# Altium project PIF_robot.PrjPcb
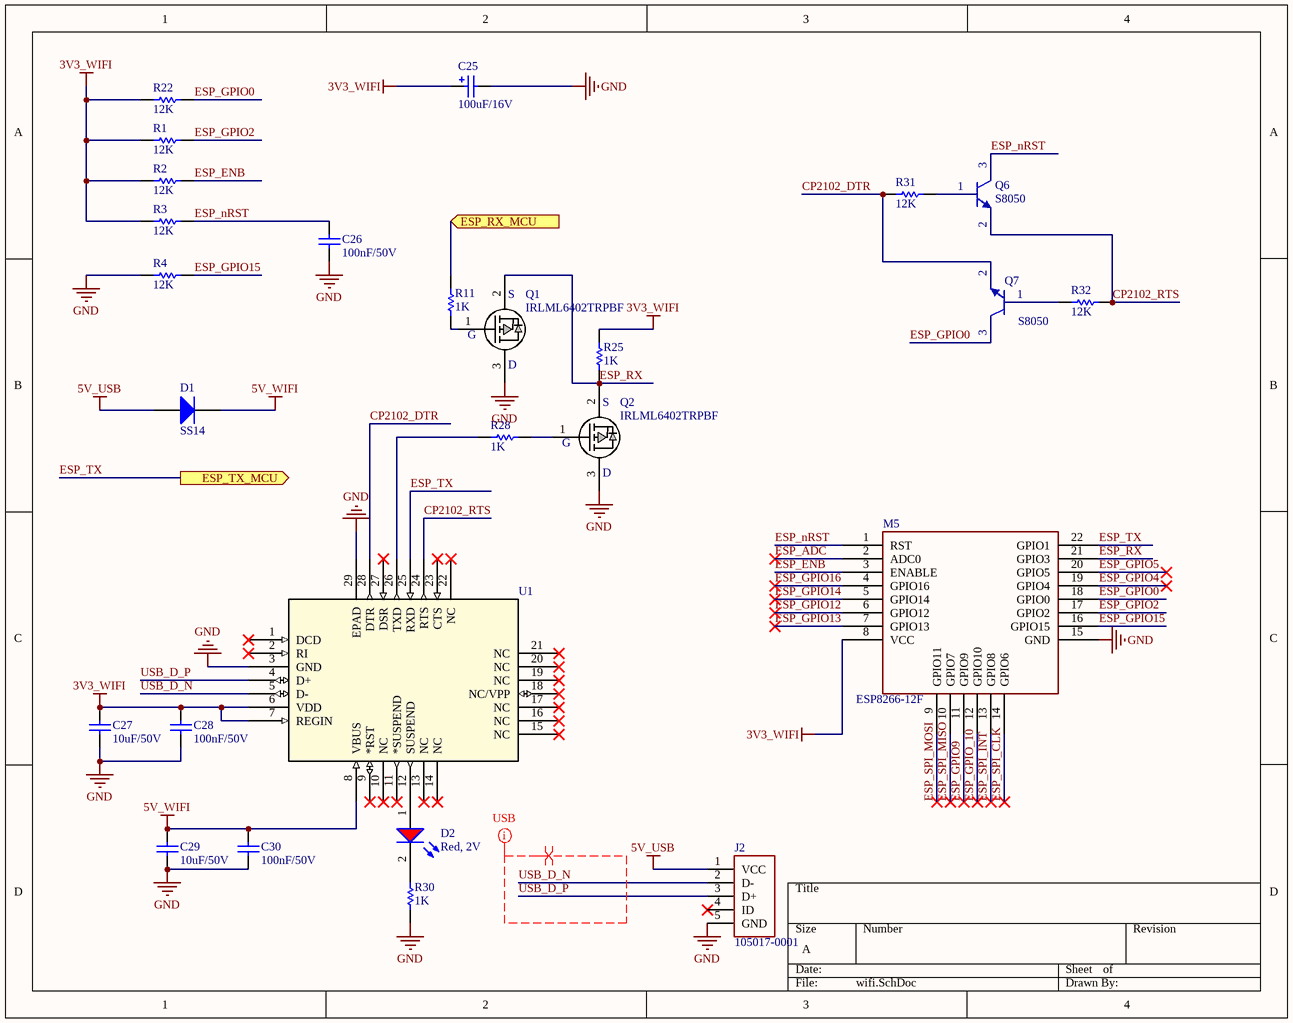
[diagram p0: wifi.SchDoc]
8 sheets, 159 parts. Net scope: flat (ports and power ports of the same name join across sheets).
Board file: PIF_robot.PcbDoc
Sheets:
  wifi.SchDoc
  Sensor.SchDoc
  RF.SchDoc
  Motor Control.SchDoc
  Decawave.schdoc
  Power_Supply.SchDoc
  Bluetooth.SchDoc
  MCU.schdoc

## Sheet wifi.SchDoc
size A

### Parts
C25  value 100uF/16V  [CAP_SM_TAN]  (hidden comment: TAJB107M006RNJ)
C26  value 100nF/50V  [CAP-SM-0805]  (hidden comment: Cap-100nF-50V-0805)
C27  value 10uF/50V  [CAP-SM-0805]  (hidden comment: Cap-10uF-50V-0805)
C28  value 100nF/50V  [CAP-SM-0805]  (hidden comment: Cap-100nF-50V-0805)
C29  value 10uF/50V  [CAP-SM-0805]  (hidden comment: Cap-10uF-50V-0805)
C30  value 100nF/50V  [CAP-SM-0805]  (hidden comment: Cap-100nF-50V-0805)
D1  SS14  [SS14]
D2  value Red, 2V  [LED_0805_Blue]  (hidden comment: LED-RED-TH-3mm)
J2  105017-0001  [CONN_105017-0001]
M5  ESP8266-12F  [ESP8266-12F]
Q1  IRLML6402TRPBF  [SOT23_NEX]
Q2  IRLML6402TRPBF  [SOT23_NEX]
Q6  S8050  [SOT23_NEX]
Q7  S8050  [SOT23_NEX]
R1  value 12K  [RES-SM-0805]  (hidden comment: Res-12K-0805)
R2  value 12K  [RES-SM-0805]  (hidden comment: Res-12K-0805)
R3  value 12K  [RES-SM-0805]  (hidden comment: Res-12K-0805)
R4  value 12K  [RES-SM-0805]  (hidden comment: Res-12K-0805)
R11  value 1K  [RES-SM-0805]  (hidden comment: Res-1K-0805)
R22  value 12K  [RES-SM-0805]  (hidden comment: Res-12K-0805)
R25  value 1K  [RES-SM-0805]  (hidden comment: Res-1K-0805)
R28  value 1K  [RES-SM-0805]  (hidden comment: Res-1K-0805)
R30  value 1K  [RES-SM-0805]  (hidden comment: Res-1K-0805)
R31  value 12K  [RES-SM-0805]  (hidden comment: Res-12K-0805)
R32  value 12K  [RES-SM-0805]  (hidden comment: Res-12K-0805)
U1  (no value)  [CP2102-GM]

### Ports
ESP_RX_MCU (in), ESP_TX_MCU (out)

### Nets
3V3_WIFI: C25.1 C27.2 C28.2 M5.8(VCC) R1.1 R2.1 R3.1 R22.1 R25.1 U1.6(VDD) U1.7(REGIN)
5V_USB: D1.2(A) J2.1(VCC)
5V_WIFI: C29.2 C30.2 D1.1(K) U1.8(VBUS)
GND: C25.2 C26.1 C27.1 C28.1 C29.1 C30.1 J2.5(GND) M5.15(GND) Q1.3(D) Q2.3(D) R4.1 R30.1 U1.3(GND) U1.29(EPAD)
CP2102_DTR: Q7.2(E) R31.1 U1.28(DTR)
CP2102_RTS: Q6.2(E) R32.2 U1.24(RTS)
ESP_ADC: M5.2(ADC0)
ESP_ENB: M5.3(ENABLE) R2.2
ESP_GPIO0: M5.18(GPIO0) Q7.3(C) R22.2
ESP_GPIO2: M5.17(GPIO2) R1.2
ESP_GPIO4: M5.19(GPIO4)
ESP_GPIO5: M5.20(GPIO5)
ESP_GPIO9: M5.11(GPIO9)
ESP_GPIO12: M5.6(GPIO12)
ESP_GPIO13: M5.7(GPIO13)
ESP_GPIO14: M5.5(GPIO14)
ESP_GPIO15: M5.16(GPIO15) R4.2
ESP_GPIO16: M5.4(GPIO16)
ESP_GPIO_10: M5.12(GPIO10)
ESP_nRST: C26.2 M5.1(RST) Q6.3(C) R3.2
ESP_RX: M5.21(GPIO3) Q1.2(S) Q2.2(S) R25.2
ESP_SPI_CLK: M5.14(GPIO6)
ESP_SPI_INT: M5.13(GPIO8)
ESP_SPI_MISO: M5.10(GPIO7)
ESP_SPI_MOSI: M5.9(GPIO11)
ESP_TX: M5.22(GPIO1) U1.25(RXD) ; port ESP_TX_MCU
USB_D_N: J2.2(D-) U1.5(D-)
USB_D_P: J2.3(D+) U1.4(D+)
NetD2_1: D2.1(A) U1.12(SUSPEND)
NetD2_2: D2.2(K) R30.2
NetQ1_1: Q1.1(G) R11.1
NetQ2_1: Q2.1(G) R28.2
NetQ6_1: Q6.1(B) R31.2
NetQ7_1: Q7.1(B) R32.1
NetR11_2: R11.2 ; port ESP_RX_MCU
NetR28_1: R28.1 U1.26(TXD)

Not connected (* = marked no-connect by the designer): J2 4(ID)*; U1 1(DCD)* 2(RI)* 9(*RST)* 10(NC)* 11(*SUSPEND)* 13(NC)* 14(NC)* 15(NC)* 16(NC)* 17(NC)* 18(NC/VPP)* 19(NC)* 20(NC)* 21(NC)* 22(NC)* 23(CTS)* 27(DSR)*

### Layout directives
net class USB: USB_D_N, USB_D_P
differential pair: USB_D_N, USB_D_P

### Library data of the parts
C25 = Cap-Tan-100uF-16V: Manufacturer: Nichicon; Manufacturer Part Number: UWX1C101MCL1GB; Local Supplier: icdayroi; Local Supplier Link: https://icdayroi.com/tu-tantalum-100uf-16v-smd6032; Supplier 1: Digikey; Supplier 1 Part Number: 493-2105-1-ND; Supplier 1 Link: https://www.digikey.com/product-detail/en/nichicon/UWX1C101MCL1GB/493-2105-1-ND/590080
C26 C28 C30 = Cap-100nF-50V-0805: CAP CER 0.1UF 50V Y5V 0805; Manufacturer: Samsung Electro-Mechanics; Manufacturer Part Number: CL21F104ZBCNNNC; Local Supplier: thegioiic; Local Supplier Link: https://thegioiic.com/products/tu-100nf-0-1uf-50v-0805; Supplier 1: Digikey; Supplier 1 Part Number: 1276-1007-1-ND; Supplier 1 Link: https://www.digikey.com/product-detail/en/samsung-electro-mechanics/CL21F104ZBCNNNC/1276-1007-1-ND/3889093
C27 C29 = Cap-10uF-50V-0805: CAP CER 10UF 50V X5R 0805; Manufacturer: Yageo; Manufacturer Part Number: CC0805KKX5R9BB106; Local Supplier: thegioiic; Local Supplier Link: https://thegioiic.com/products/tu-10uf-50v-0805; Supplier 1: Digikey; Supplier 1 Link: https://www.digikey.com/product-detail/en/yageo/CC0805KKX5R9BB106/311-3499-2-ND/7164383; Supplier 1 Part Number: 311-3499-2-ND
D1 = Diode-SS14: DIODE SCHOTTKY 40V 1A SMA; Manufacturer: ON Semiconductor; Local Supplier: thegioiic; Local Supplier Link: https://thegioiic.com/products/ss14-sma; Supplier 1: Digikey; Supplier 1 Link: https://www.digikey.com/product-detail/en/on-semiconductor/SS14/SS14CT-ND/965729; Manufacturer Part Number: SS14; Supplier 1 Part Number: SS14CT-ND
D2 = LED-RED-TH-3mm: LED RED CLEAR T-1 T/H; Manufacturer: Kingbright; Manufacturer Part Number: WP710A10SEC/J3; Local Supplier: thegioiic; Local Supplier Link: https://thegioiic.com/products/led-do-3mm-chan-dai; Supplier 1: Digikey; Supplier 1 Link: https://www.digikey.com/product-detail/en/kingbright/WP710A10SEC-J3/754-1589-ND/2769815; Supplier 1 Part Number: 754-1589-ND
J2 = 105017-0001: No Description Available; Vendor: Molex Connector Corporation; Built_By: EMA_Cory; SourceLibrary: Molex_2020-05-26; Datasheet: https://www.molex.com/pdm_docs/sd/1050170001_sd.pdf; Manufacturer_Part_Number: 105017-0001; Copyright: Copyright (C) 2018 Accelerated Designs. All rights reserved; RefDes: RefDes; Type: DEV
Q1 Q2 = IRLML6402TRPBF: P-Channel 20V 3.7A (Ta) 1.3W (Ta) Surface Mount Micro3™/SOT-23
R1-R4 R22 R31 R32 = Res-12K-0805: RES 12 KOHM JUMPER 0805; Manufacturer: Vishay Thin Film; Manufacturer Part Number: PAT0805E3121BST1; Local Supplier: icdayroi; Local Supplier Link: https://icdayroi.com/dien-tro-12k-0805-1-goi-50-con; Supplier 1: Digikey; Supplier 1 Link: https://www.digikey.com/product-detail/en/vishay-thin-film/PAT0805E3121BST1/PAT0805E3121BST1-ND/2281536; Supplier 1 Part Number: PAT0805E3121BST1-ND
R11 R25 R28 R30 = Res-1K-0805: RES 1K OHM 1% 1/4W 0805; Manufacturer: Stackpole Electronics Inc; Manufacturer Part Number: RNCP0805FTD1K00; Local Supplier: thegioiic; Local Supplier Link: https://thegioiic.com/products/dien-tro-1k-ohm-0805-5; Supplier 1: Digikey; Supplier 1 Link: https://www.digikey.com/product-detail/en/stackpole-electronics-inc/RNCP0805FTD1K00/RNCP0805FTD1K00CT-ND/2240568; Supplier 1 Part Number: RNCP0805FTD1K00CT-ND
U1 = CP2102-GM: No Description Available; Vendor: Silicon Labs; Built_By: EMA_UL_Team; SourceLibrary: Silicon_Labs_2015-03-23; Manufacturer_Part_Number: CP2102-GM; Copyright: Copyright (C) 2018 Accelerated Designs. All rights reserved; RefDes: RefDes; Type: DEV
M5 = ESP8266-12F: Local Supplier: HShop; Local Supplier Link: https://hshop.vn/products/mach-thu-phat-wifi-soc-esp8266-v12; Local Supplier Part Number: HS000912; Manufacturer: *; Manufacturer Part Number: *

## Sheet Sensor.SchDoc
size A
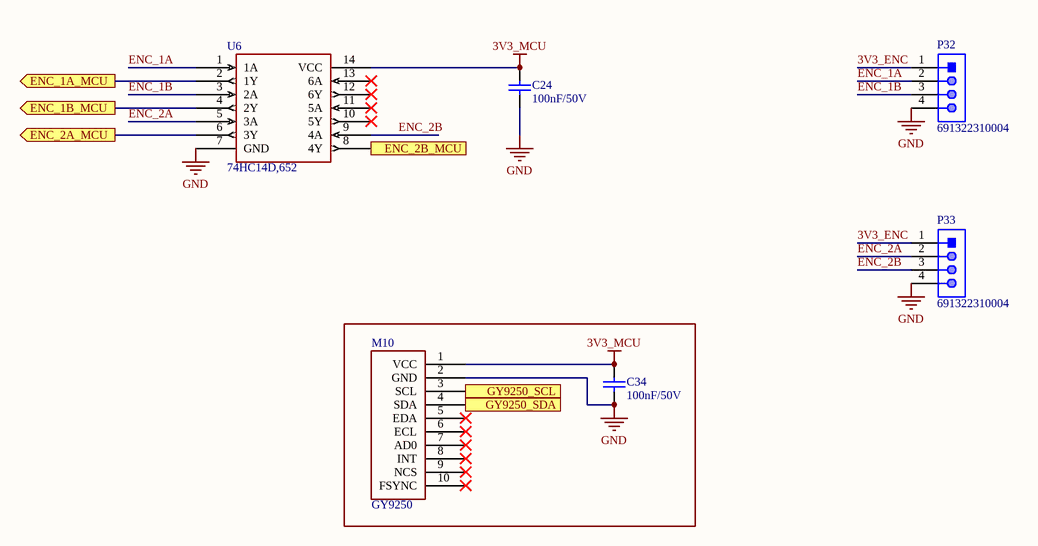
[diagram p1: Sensor.SchDoc]

### Parts
C24  value 100nF/50V  [CAP-SM-0805]  (hidden comment: Cap-100nF-50V-0805)
C34  value 100nF/50V  [CAP-SM-0805]  (hidden comment: Cap-100nF-50V-0805)
M10  GY9250  [GY9250]
P32  691322310004  [691322310004]
P33  691322310004  [691322310004]
U6  74HC14D,652  [SOT108-1_NEX]

### Ports
ENC_1A_MCU (out), ENC_1B_MCU (out), ENC_2A_MCU (out), ENC_2B_MCU (out), GY9250_SCL (in), GY9250_SDA (in)

### Nets
3V3_MCU: C24.2 C34.2 M10.1(VCC) U6.14(VCC)  [project net 3V3_MC]
GND: C24.1 C34.1 M10.2(GND) P32.4 P33.4 U6.7(GND)
3V3_ENC: P32.1 P33.1
ENC_1A: P32.2 U6.1(1A)
ENC_1B: P32.3 U6.3(2A)
ENC_2A: P33.2 U6.5(3A)
ENC_2B: P33.3 U6.9(4A)
NetM10_3: M10.3(SCL) ; port GY9250_SCL
NetM10_4: M10.4(SDA) ; port GY9250_SDA
NetU3_16: U6.2(1Y) ; port ENC_1A_MCU
NetU3_17: U6.4(2Y) ; port ENC_1B_MCU
NetU3_42: U6.8(4Y) ; port ENC_2B_MCU
NetU3_43: U6.6(3Y) ; port ENC_2A_MCU

Not connected (* = marked no-connect by the designer): M10 5(EDA)* 6(ECL)* 7(AD0)* 8(INT)* 9(NCS)* 10(FSYNC)*; U6 10(5Y)* 11(5A)* 12(6Y)* 13(6A)*

### Library data of the parts
C24 C34 = Cap-100nF-50V-0805: as C26 on sheet wifi; Local Supplier: thegioiic; Local Supplier Link: https://thegioiic.com/products/tu-100nf-0-1uf-50v-0805; Supplier 1: Digikey; Supplier 1 Part Number: 1276-1007-1-ND; Supplier 1 Link: https://www.digikey.com/product-detail/en/samsung-electro-mechanics/CL21F104ZBCNNNC/1276-1007-1-ND/3889093
P32 P33 = 691322310004: WR-TBL Serie 322 Horizontal PCB Header, Pluggable, pitch 3.81mm, 4p; Compliance: RoHS; Modularity: No; Pin Number: 4; Rated Current [UL]: 10A; Working Voltage [UL]: 300VAC; ComponentLink1Description: Manufacturer; ComponentLink1URL: http://www.we-online.de; ComponentLink2URL: https://katalog.we-online.de/em/datasheet/691322310004.pdf; ComponentLink2Description: Datasheet; Mounting Technology: THT; Part Number: 691322310004; Packaging: Box; Operating Temperature: -40 to +105degC; PCB/Cable/Panel: PCB; Pitch: 3.81mm; Published Date: October 2019; Type: Horizontal; Publisher: Wurth Elektronik; Application: Pluggable
M10 = GY9250: Local Supplier: HShop; Local Supplier Link: *; Local Supplier Part Number: *; Manufacturer: *; Manufacturer Part Number: *

## Sheet RF.SchDoc
size A
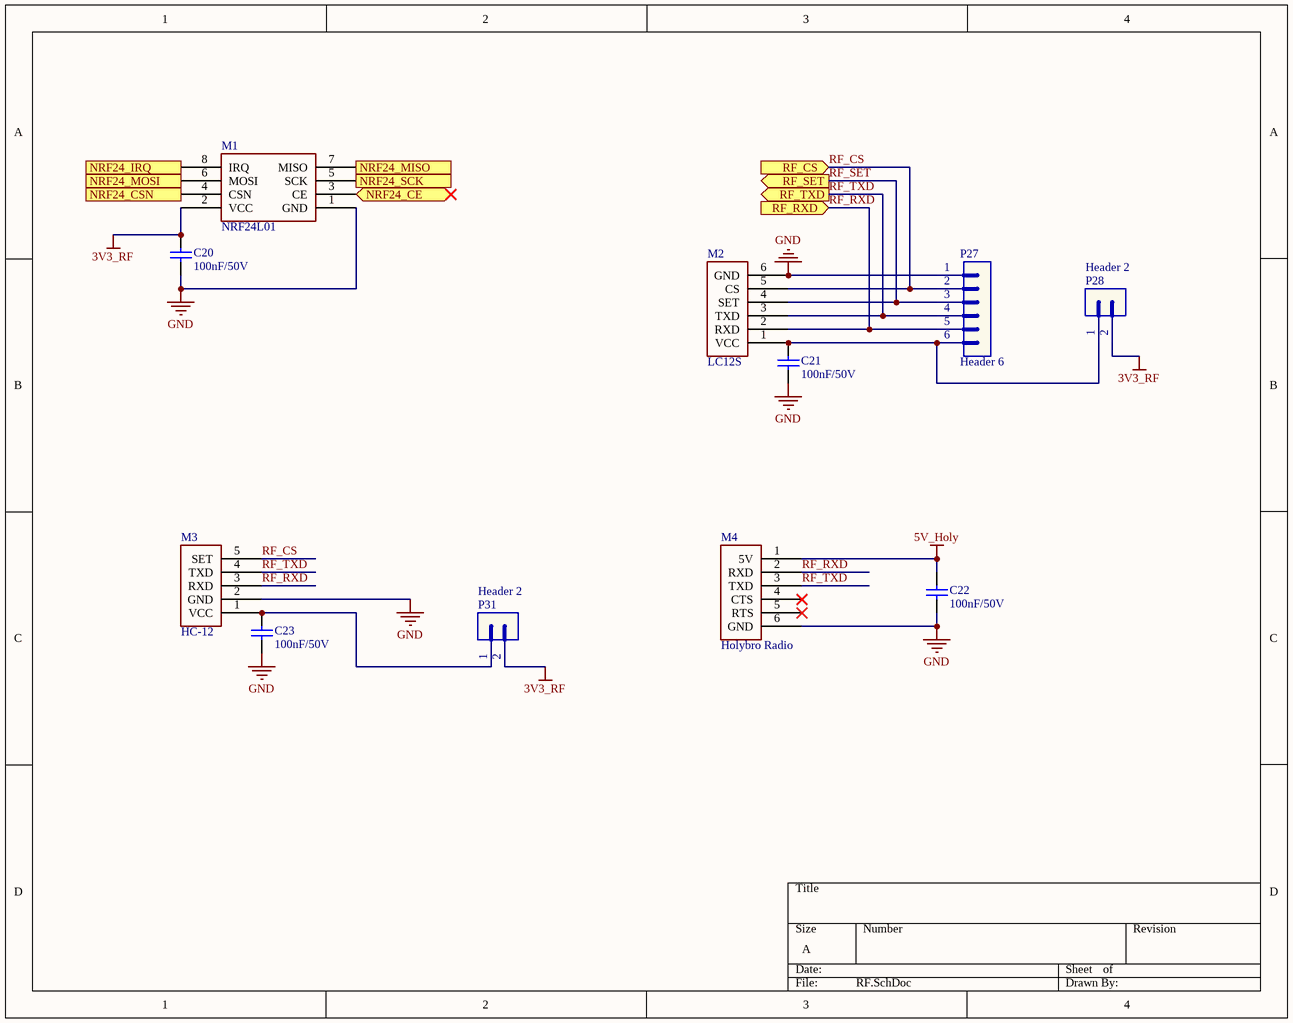
[diagram p2: RF.SchDoc]

### Parts
C20  value 100nF/50V  [CAP-SM-0805]  (hidden comment: Cap-100nF-50V-0805)
C21  value 100nF/50V  [CAP-SM-0805]  (hidden comment: Cap-100nF-50V-0805)
C22  value 100nF/50V  [CAP-SM-0805]  (hidden comment: Cap-100nF-50V-0805)
C23  value 100nF/50V  [CAP-SM-0805]  (hidden comment: Cap-100nF-50V-0805)
M1  NRF24L01  [NRF24L01]
M2  LC12S  [LC12S]
M3  HC-12  [HC-12]
M4  Holybro Radio  [Holybro-Radio]
P27  Header 6  [JP6]
P28  Header 2  [JP2]
P31  Header 2  [JP2]

### Ports
NRF24_CE (bidir), NRF24_CSN (in), NRF24_IRQ (out), NRF24_MISO (out), NRF24_MOSI (in), NRF24_SCK (in), RF_CS (in), RF_RXD (in), RF_SET (out), RF_TXD (out)

### Nets
3V3_RF: C20.2 M1.2(VCC) P28.2 P31.2
5V_Holy: C22.2 M4.1(5V)  [project net 5V]
GND: C20.1 C21.1 C22.1 C23.1 M1.1(GND) M2.6(GND) M3.2(GND) M4.6(GND) P27.1
RF_CS: M2.5(CS) M3.5(SET) P27.2 ; port RF_CS
RF_RXD: M2.2(RXD) M3.3(RXD) M4.2(RXD) P27.5 ; port RF_RXD
RF_SET: M2.4(SET) P27.3 ; port RF_SET  [project net BOOT1]
RF_TXD: M2.3(TXD) M3.4(TXD) M4.3(TXD) P27.4 ; port RF_TXD
NetC21_2: C21.2 M2.1(VCC) P27.6 P28.1
NetC23_2: C23.2 M3.1(VCC) P31.1
NetM1_3: M1.3(CE) ; port NRF24_CE
NetM1_4: M1.4(CSN) ; port NRF24_CSN
NetM1_5: M1.5(SCK) ; port NRF24_SCK
NetM1_6: M1.6(MOSI) ; port NRF24_MOSI
NetM1_7: M1.7(MISO) ; port NRF24_MISO
NetM1_8: M1.8(IRQ) ; port NRF24_IRQ

Not connected (* = marked no-connect by the designer): M4 4(CTS)* 5(RTS)*

### Library data of the parts
C20-C23 = Cap-100nF-50V-0805: as C26 on sheet wifi; Local Supplier: thegioiic; Local Supplier Link: https://thegioiic.com/products/tu-100nf-0-1uf-50v-0805; Supplier 1: Digikey; Supplier 1 Part Number: 1276-1007-1-ND; Supplier 1 Link: https://www.digikey.com/product-detail/en/samsung-electro-mechanics/CL21F104ZBCNNNC/1276-1007-1-ND/3889093
P27 = Header 6: Header, 6-Pin; LatestRevisionDate: 17-Jul-2002; LatestRevisionNote: Re-released for DXP Platform.; Publisher: Altium Limited
P28 P31 = Header 2: Header, 2-Pin; LatestRevisionDate: 17-Jul-2002; LatestRevisionNote: Re-released for DXP Platform.; Publisher: Altium Limited
M1 = NRF24L01: Local Supplier Link: https://hshop.vn/products/mach-thu-phat-nrf24l01-pa-2-4ghzcu-khech-dai-cung-suat-thu-phat; Local Supplier: HShop; Local Supplier Part Number: HS000888; Manufacturer: *; Manufacturer Part Number: *
M2 = LC12S: Local Supplier Link: https://hshop.vn/products/mach-thu-phat-rf-uart-lc12s-2-4ghz?fbclid=IwAR3h1hU0io-Cc4GBL9Q-KMB_-TKtvE-b63OAEmRNHthVrXHliy_JpDId3Yg; Local Supplier: HShop; Local Supplier Part Number: HS00095; Manufacturer: *; Manufacturer Part Number: *
M3 = HC-12: Local Supplier: HShop; Local Supplier Link: https://hshop.vn/products/mach-thu-phat-rf-uart-si4463-433mhzkhoang-coch-1km; Local Supplier Part Number: HS000897; Manufacturer: *; Manufacturer Part Number: *
M4 = Holybro Radio: Local Supplier: *; Local Supplier Link: https://www.lazada.vn/products/ld-holybro-433mhz-915-mhz-500-mw-thu-phat-vo-tuyen-xa-bo-v3-cho-pixhawk-4-dieu-khien-chuyen-bay-i430804435-s768474304.html?spm=a2o4n.searchlist.list.4.25396b19yIS9XO&search=1; Local Supplier Part Number: *; Manufacturer: *; Manufacturer Part Number: *

## Sheet Motor Control.SchDoc
size A
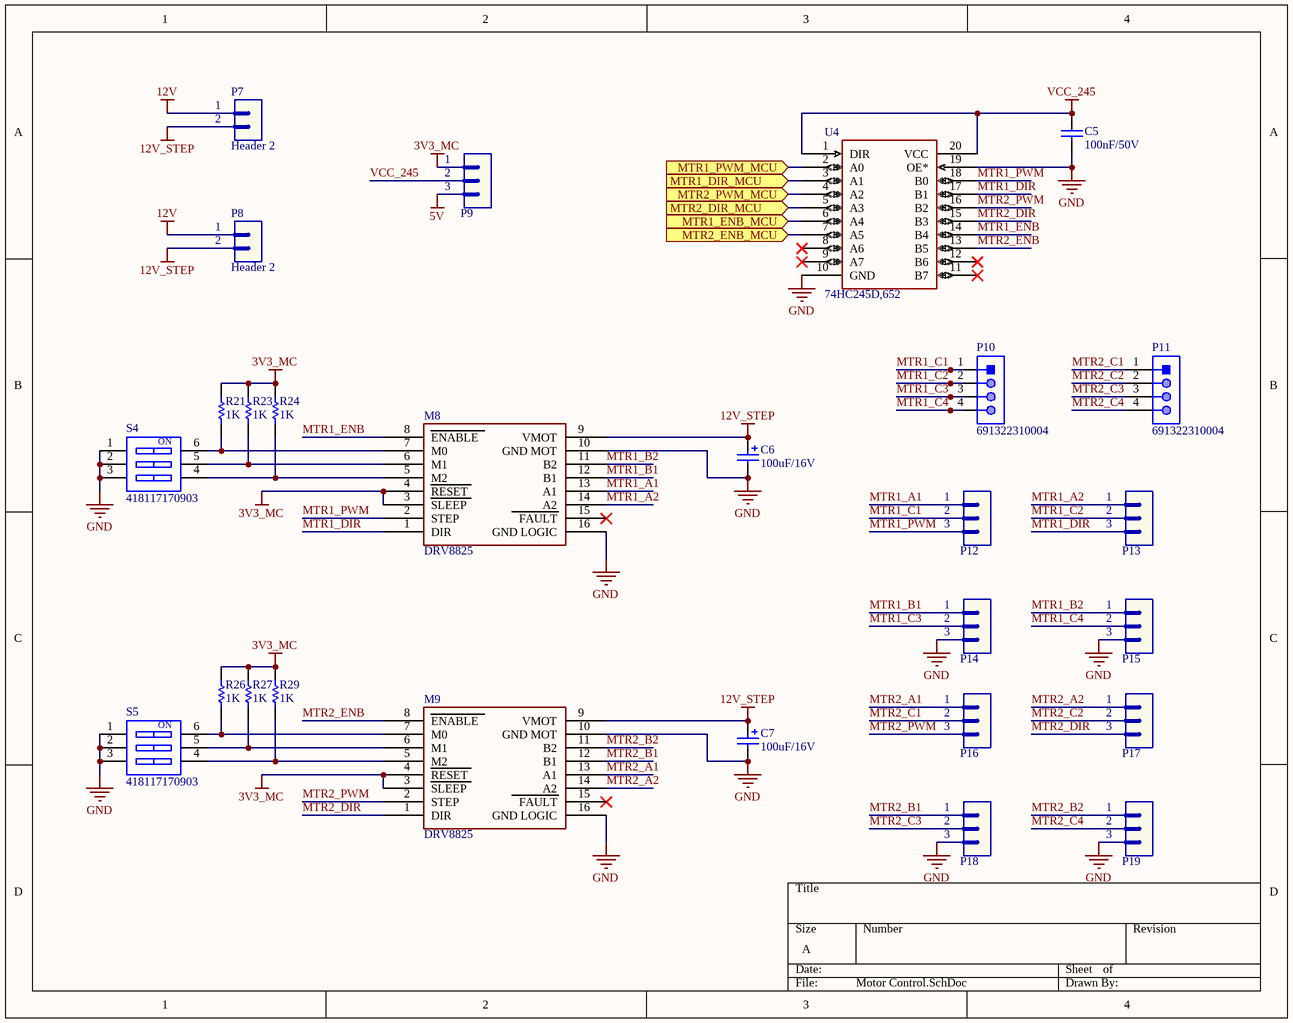
[diagram p3: Motor Control.SchDoc]

### Parts
C5  value 100nF/50V  [CAP-SM-0805]  (hidden comment: Cap-100nF-50V-0805)
C6  value 100uF/16V  [CAP-SM-AL-SIZE-D-D6L6]  (hidden comment: Cap-Al-100uF-16V-D6L5)
C7  value 100uF/16V  [CAP-SM-AL-SIZE-D-D6L6]  (hidden comment: Cap-Al-100uF-16V-D6L5)
M8  DRV8825  [DRV8825]
M9  DRV8825  [DRV8825]
P7  Header 2  [JP2]
P8  Header 2  [JP2]
P9  Header 3  [JP3]  (value not drawn)
P10  691322310004  [691322310004]
P11  691322310004  [691322310004]
P12  Header 3  [JP3]  (value not drawn)
P13  Header 3  [JP3]  (value not drawn)
P14  Header 3  [JP3]  (value not drawn)
P15  Header 3  [JP3]  (value not drawn)
P16  Header 3  [JP3]  (value not drawn)
P17  Header 3  [JP3]  (value not drawn)
P18  Header 3  [JP3]  (value not drawn)
P19  Header 3  [JP3]  (value not drawn)
R21  value 1K  [RES-SM-0805]  (hidden comment: Res-1K-0805)
R23  value 1K  [RES-SM-0805]  (hidden comment: Res-1K-0805)
R24  value 1K  [RES-SM-0805]  (hidden comment: Res-1K-0805)
R26  value 1K  [RES-SM-0805]  (hidden comment: Res-1K-0805)
R27  value 1K  [RES-SM-0805]  (hidden comment: Res-1K-0805)
R29  value 1K  [RES-SM-0805]  (hidden comment: Res-1K-0805)
S4  418117170903  [418117170903]
S5  418117170903  [418117170903]
U4  74HC245D,652  [SOT163-1_NEX]

### Ports
MTR1_DIR_MCU (in), MTR1_ENB_MCU (in), MTR1_PWM_MCU (in), MTR2_DIR_MCU (in), MTR2_ENB_MCU (in), MTR2_PWM_MCU (in)

### Nets
3V3_MC: M8.3(SLEEP) M8.4(RESET) M9.3(SLEEP) M9.4(RESET) P9.1 R21.2 R23.2 R24.2 R26.2 R27.2 R29.2
5V: P9.3
12V: P7.1 P8.1
12V_STEP: C6.1 C7.1 M8.9(VMOT) M9.9(VMOT) P7.2 P8.2
GND: C5.1 C6.2 C7.2 M8.10(GND_MOT) M8.16(GND_LOGIC) M9.10(GND_MOT) M9.16(GND_LOGIC) P14.3 P15.3 P18.3 P19.3 S4.1 S4.2 S4.3 S5.1 S5.2 S5.3 U4.10(GND) U4.19(OE*)
VCC_245: C5.2 P9.2 U4.1(DIR) U4.20(VCC)
MTR1_A1: M8.13(A1) P12.1
MTR1_A2: M8.14(A2) P13.1
MTR1_B1: M8.12(B1) P14.1
MTR1_B2: M8.11(B2) P15.1
MTR1_C1: P10.1 P12.2
MTR1_C2: P10.2 P13.2
MTR1_C3: P10.3 P14.2
MTR1_C4: P10.4 P15.2
MTR1_DIR: M8.1(DIR) P13.3 U4.17(B1)
MTR1_ENB: M8.8(ENABLE) U4.14(B4)
MTR1_PWM: M8.2(STEP) P12.3 U4.18(B0)
MTR2_A1: M9.13(A1) P16.1
MTR2_A2: M9.14(A2) P17.1
MTR2_B1: M9.12(B1) P18.1
MTR2_B2: M9.11(B2) P19.1
MTR2_C1: P11.1 P16.2
MTR2_C2: P11.2 P17.2
MTR2_C3: P11.3 P18.2
MTR2_C4: P11.4 P19.2
MTR2_DIR: M9.1(DIR) P17.3 U4.15(B3)
MTR2_ENB: M9.8(ENABLE) U4.13(B5)
MTR2_PWM: M9.2(STEP) P16.3 U4.16(B2)
NetM8_5: M8.5(M2) R24.1 S4.4
NetM8_6: M8.6(M1) R23.1 S4.5
NetM8_7: M8.7(M0) R21.1 S4.6
NetM9_5: M9.5(M2) R29.1 S5.4
NetM9_6: M9.6(M1) R27.1 S5.5
NetM9_7: M9.7(M0) R26.1 S5.6
NetU3_3: U4.3(A1) ; port MTR1_DIR_MCU
NetU3_4: U4.6(A4) ; port MTR1_ENB_MCU
NetU3_5: U4.5(A3) ; port MTR2_DIR_MCU
NetU3_6: U4.7(A5) ; port MTR2_ENB_MCU
NetU3_10: U4.2(A0) ; port MTR1_PWM_MCU
NetU3_11: U4.4(A2) ; port MTR2_PWM_MCU

Not connected (* = marked no-connect by the designer): M8 15(FAULT)*; M9 15(FAULT)*; U4 8(A6)* 9(A7)* 11(B7)* 12(B6)*

### Notes on the sheet
- (in symbol 418117170903) ON

### Library data of the parts
C5 = Cap-100nF-50V-0805: as C26 on sheet wifi; Local Supplier: thegioiic; Local Supplier Link: https://thegioiic.com/products/tu-100nf-0-1uf-50v-0805; Supplier 1: Digikey; Supplier 1 Part Number: 1276-1007-1-ND; Supplier 1 Link: https://www.digikey.com/product-detail/en/samsung-electro-mechanics/CL21F104ZBCNNNC/1276-1007-1-ND/3889093
C6 C7 = Cap-Al-100uF-16V-D6L5: CAP ALUM 100UF 20% 16V SMD; Manufacturer: Nichicon; Manufacturer Part Number: UWX1C101MCL1GB; Local Supplier: thegioiic; Local Supplier Link: https://thegioiic.com/products/tu-nhom-smd-100uf-16v-d6-3l5-4; Supplier 1: Digikey; Supplier 1 Part Number: 493-2105-1-ND; Supplier 1 Link: https://www.digikey.com/product-detail/en/nichicon/UWX1C101MCL1GB/493-2105-1-ND/590080
P7 P8 = Header 2: Header, 2-Pin; LatestRevisionDate: 17-Jul-2002; LatestRevisionNote: Re-released for DXP Platform.; Publisher: Altium Limited
P9 P12-P19 = Header 3: Header, 3-Pin; LatestRevisionDate: 17-Jul-2002; LatestRevisionNote: Re-released for DXP Platform.; Publisher: Altium Limited
P10 P11 = 691322310004: as P32 on sheet Sensor; ComponentLink1Description: Manufacturer; ComponentLink1URL: http://www.we-online.de; ComponentLink2URL: https://katalog.we-online.de/em/datasheet/691322310004.pdf; ComponentLink2Description: Datasheet; Mounting Technology: THT; Part Number: 691322310004; Packaging: Box; Operating Temperature: -40 to +105degC; PCB/Cable/Panel: PCB; Pitch: 3.81mm; Published Date: October 2019; Type: Horizontal; Publisher: Wurth Elektronik; Application: Pluggable
R21 R23 R24 R26 R27 R29 = Res-1K-0805: as R11 on sheet wifi; Local Supplier: thegioiic; Local Supplier Link: https://thegioiic.com/products/dien-tro-1k-ohm-0805-5; Supplier 1: Digikey; Supplier 1 Link: https://www.digikey.com/product-detail/en/stackpole-electronics-inc/RNCP0805FTD1K00/RNCP0805FTD1K00CT-ND/2240568; Supplier 1 Part Number: RNCP0805FTD1K00CT-ND
S4 S5 = 418117170903: WS-DITV Compact THT Dip Switch, Flat Actuator, pitch 2.54mm, 3p; Operation Force: 800g; Pole Number: 3; Actuator Type: Flat Type; Circuit: SPST-NO; Rated Current Switching: 25mA; Rated Current Non-Switching: 100mA; Rated Voltage Non-Switching: 50VDC; Rated Voltage Switching: 24VDC; ComponentLink1Description: Manufacturer; ComponentLink1URL: http://www.we-online.de; ComponentLink2Description: Datasheet; ComponentLink2URL: https://katalog.we-online.com/em/datasheet/418117170903.pdf; Pitch: 2.54mm; Contact Material: Copper Alloy; Mounting Technology: THT; Operating Temperature: -40 to +85degC; Contact Plating: Gold; Packaging: Tube; Part Number: 418117170903; Publisher: Wurth Elektronik; Published Date: September 2019
M8 M9 = DRV8825: Local Supplier: HShop; Local Supplier Link: https://hshop.vn/products/mach-dieu-khien-dong-co-buoc-drv8825; Local Supplier Part Number: HS000686; Manufacturer: *; Manufacturer Part Number: *

## Sheet Decawave.schdoc
size B
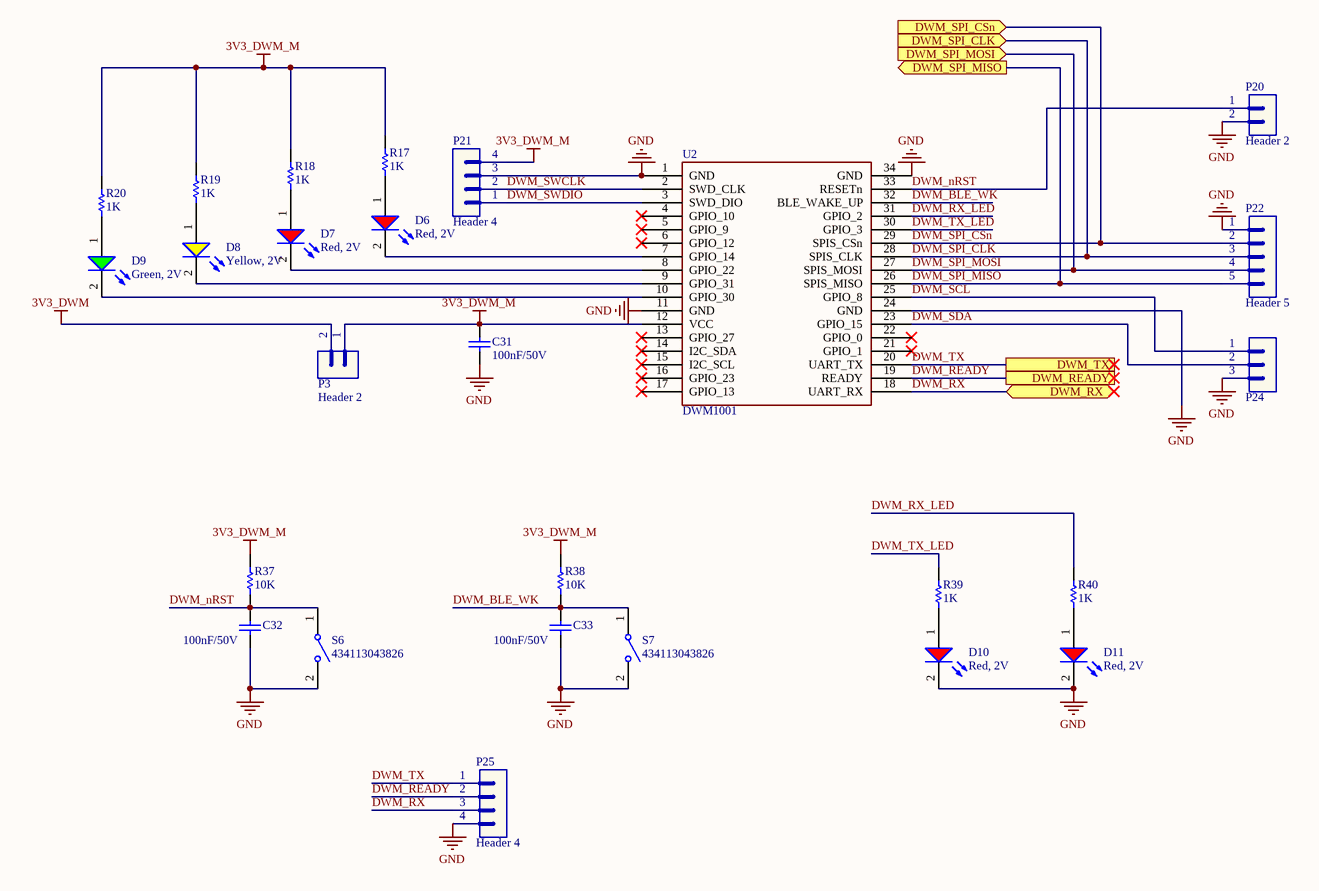
[diagram p4: Decawave.schdoc]

### Parts
C31  value 100nF/50V  [CAP-SM-0805]  (hidden comment: Cap-100nF-50V-0805)
C32  value 100nF/50V  [CAP-SM-0805]  (hidden comment: Cap-100nF-50V-0805)
C33  value 100nF/50V  [CAP-SM-0805]  (hidden comment: Cap-100nF-50V-0805)
D6  value Red, 2V  [LED_0805_Blue]  (hidden comment: LED-RED-TH-3mm)
D7  value Red, 2V  [LED_0805_Blue]  (hidden comment: LED-RED-TH-3mm)
D8  value Yellow, 2V  [LED_0805_Blue]  (hidden comment: LED-YELLOW-TH-3mm)
D9  value Green, 2V  [LED_0805_Blue]  (hidden comment: LED-GREEN-TH-3mm)
D10  value Red, 2V  [LED_0805_Blue]  (hidden comment: LED-RED-TH-3mm)
D11  value Red, 2V  [LED_0805_Blue]  (hidden comment: LED-RED-TH-3mm)
P3  Header 2  [JP2]
P20  Header 2  [JP2]
P21  Header 4  [JP4]
P22  Header 5  [JP5]
P24  Header 3  [JP3]  (value not drawn)
P25  Header 4  [JP4]
R17  value 1K  [RES-SM-0805]  (hidden comment: Res-1K-0805)
R18  value 1K  [RES-SM-0805]  (hidden comment: Res-1K-0805)
R19  value 1K  [RES-SM-0805]  (hidden comment: Res-1K-0805)
R20  value 1K  [RES-SM-0805]  (hidden comment: Res-1K-0805)
R37  value 10K  [RES-SM-0805]  (hidden comment: Res-10k-0805)
R38  value 10K  [RES-SM-0805]  (hidden comment: Res-10k-0805)
R39  value 1K  [RES-SM-0805]  (hidden comment: Res-1K-0805)
R40  value 1K  [RES-SM-0805]  (hidden comment: Res-1K-0805)
S6  434113043826  [434113043826]
S7  434113043826  [434113043826]
U2  DWM1001  [DWM1001]

### Ports
DWM_READY, DWM_RX (bidir), DWM_SPI_CLK (in), DWM_SPI_CSn (in), DWM_SPI_MISO (out), DWM_SPI_MOSI (in), DWM_TX

### Nets
3V3_DWM: P3.2
3V3_DWM_M: C31.2 P3.1 P21.4 R17.2 R18.2 R19.2 R20.2 R37.2 R38.2 U2.12(VCC)
GND: C31.1 C32.2 C33.2 D10.2(K) D11.2(K) P20.2 P21.3 P22.1 P24.3 P25.4 S6.2 S7.2 U2.1(GND) U2.11(GND) U2.24(GND) U2.34(GND)
DWM_BLE_WK: C33.1 R38.1 S7.1 U2.32(BLE_WAKE_UP)
DWM_nRST: C32.1 P20.1 R37.1 S6.1 U2.33(RESETn)
DWM_READY: P25.2 U2.19(READY) ; port DWM_READY
DWM_RX: P25.3 U2.18(UART_RX) ; port DWM_RX
DWM_RX_LED: R40.2 U2.31(GPIO_2)
DWM_SCL: P24.1 U2.25(GPIO_8)
DWM_SDA: P24.2 U2.23(GPIO_15)
DWM_SPI_CLK: P22.3 U2.28(SPIS_CLK) ; port DWM_SPI_CLK
DWM_SPI_CSn: P22.2 U2.29(SPIS_CSn) ; port DWM_SPI_CSn
DWM_SPI_MISO: P22.5 U2.26(SPIS_MISO) ; port DWM_SPI_MISO
DWM_SPI_MOSI: P22.4 U2.27(SPIS_MOSI) ; port DWM_SPI_MOSI
DWM_SWCLK: P21.2 U2.2(SWD_CLK)
DWM_SWDIO: P21.1 U2.3(SWD_DIO)
DWM_TX: P25.1 U2.20(UART_TX) ; port DWM_TX
DWM_TX_LED: R39.2 U2.30(GPIO_3)
NetD6_1: D6.1(A) R17.1
NetD6_2: D6.2(K) U2.7(GPIO_14)
NetD7_1: D7.1(A) R18.1
NetD7_2: D7.2(K) U2.8(GPIO_22)
NetD8_1: D8.1(A) R19.1
NetD8_2: D8.2(K) U2.9(GPIO_31)
NetD9_1: D9.1(A) R20.1
NetD9_2: D9.2(K) U2.10(GPIO_30)
NetD10_1: D10.1(A) R39.1
NetD11_1: D11.1(A) R40.1

Not connected (* = marked no-connect by the designer): U2 4(GPIO_10)* 5(GPIO_9)* 6(GPIO_12)* 13(GPIO_27)* 14(I2C_SDA)* 15(I2C_SCL)* 16(GPIO_23)* 17(GPIO_13)* 21(GPIO_1)* 22(GPIO_0)*

### Library data of the parts
C31-C33 = Cap-100nF-50V-0805: as C26 on sheet wifi; Local Supplier: thegioiic; Local Supplier Link: https://thegioiic.com/products/tu-100nf-0-1uf-50v-0805; Supplier 1: Digikey; Supplier 1 Part Number: 1276-1007-1-ND; Supplier 1 Link: https://www.digikey.com/product-detail/en/samsung-electro-mechanics/CL21F104ZBCNNNC/1276-1007-1-ND/3889093
D6 D7 D10 D11 = LED-RED-TH-3mm: as D2 on sheet wifi; Local Supplier: thegioiic; Local Supplier Link: https://thegioiic.com/products/led-do-3mm-chan-dai; Supplier 1: Digikey; Supplier 1 Link: https://www.digikey.com/product-detail/en/kingbright/WP710A10SEC-J3/754-1589-ND/2769815; Supplier 1 Part Number: 754-1589-ND
D9 = LED-GREEN-TH-3mm: LED GREEN CLEAR T-1 T/H; Manufacturer: Kingbright; Manufacturer Part Number: WP710A10ZGC/G; Local Supplier: thegioiic; Local Supplier Link: https://thegioiic.com/products/led-xanh-la-3mm-chan-dai; Supplier 1: Digikey; Supplier 1 Link: https://www.digikey.com/product-detail/en/kingbright/WP710A10ZGC-G/754-1612-ND/2769684; Supplier 1 Part Number: 754-1612-ND
P3 P20 = Header 2: Header, 2-Pin; LatestRevisionDate: 17-Jul-2002; LatestRevisionNote: Re-released for DXP Platform.; Publisher: Altium Limited
P21 P25 = Header 4: Header, 4-Pin; LatestRevisionDate: 17-Jul-2002; LatestRevisionNote: Re-released for DXP Platform.; Publisher: Altium Limited
P22 = Header 5: Header, 5-Pin; LatestRevisionDate: 17-Jul-2002; LatestRevisionNote: Re-released for DXP Platform.; Publisher: Altium Limited
P24 = Header 3: Header, 3-Pin; LatestRevisionDate: 17-Jul-2002; LatestRevisionNote: Re-released for DXP Platform.; Publisher: Altium Limited
R17-R20 R39 R40 = Res-1K-0805: as R11 on sheet wifi; Local Supplier: thegioiic; Local Supplier Link: https://thegioiic.com/products/dien-tro-1k-ohm-0805-5; Supplier 1: Digikey; Supplier 1 Link: https://www.digikey.com/product-detail/en/stackpole-electronics-inc/RNCP0805FTD1K00/RNCP0805FTD1K00CT-ND/2240568; Supplier 1 Part Number: RNCP0805FTD1K00CT-ND
R37 R38 = Res-10k-0805: RES 10K OHM 1% 1/4W 0805; Manufacturer: Stackpole Electronics Inc; Manufacturer Part Number: RNCP0805FTD10K0; Local Supplier: thegioiic; Local Supplier Link: https://thegioiic.com/products/dien-tro-10k-ohm-0805-5; Supplier 1: Digikey; Supplier 1 Link: https://www.digikey.com/product-detail/en/stackpole-electronics-inc/RNCP0805FTD10K0/RNCP0805FTD10K0CT-ND/2240601; Supplier 1 Part Number: RNCP0805FTD10K0CT-ND
S6 S7 = 434113043826: WS-TASV J-Bend SMT Tact Switch 6x3.5mm, height 4.3mm, 260gf; Rated Voltage: 12VDC; Rated Current: 50mA; Washable: No; ComponentLink1Description: Manufacturer; ComponentLink1URL: http://www.we-online.de; ComponentLink2Description: Datasheet; ComponentLink2URL: https://katalog.we-online.com/em/datasheet/434113043826.pdf; Operating Temperature: -40 to +85degC; Part Number: 434113043826; Published Date: September 2019; Contact Material: Stainless Steel; Height: 4.3mm; Mounting Technology: SMT; Contact Plating: Silver; Operation Force: 260gf; Packaging: Tape and Reel; Terminal Material: Copper Alloy; Publisher: Wurth Elektronik; Terminal Plating: Silver
U2 = DWM1001: Local Supplier: *; Local Supplier Link: *; Local Supplier Part Number: *; Manufacturer: *; Manufacturer Part Number: *

## Sheet Power_Supply.SchDoc
size A
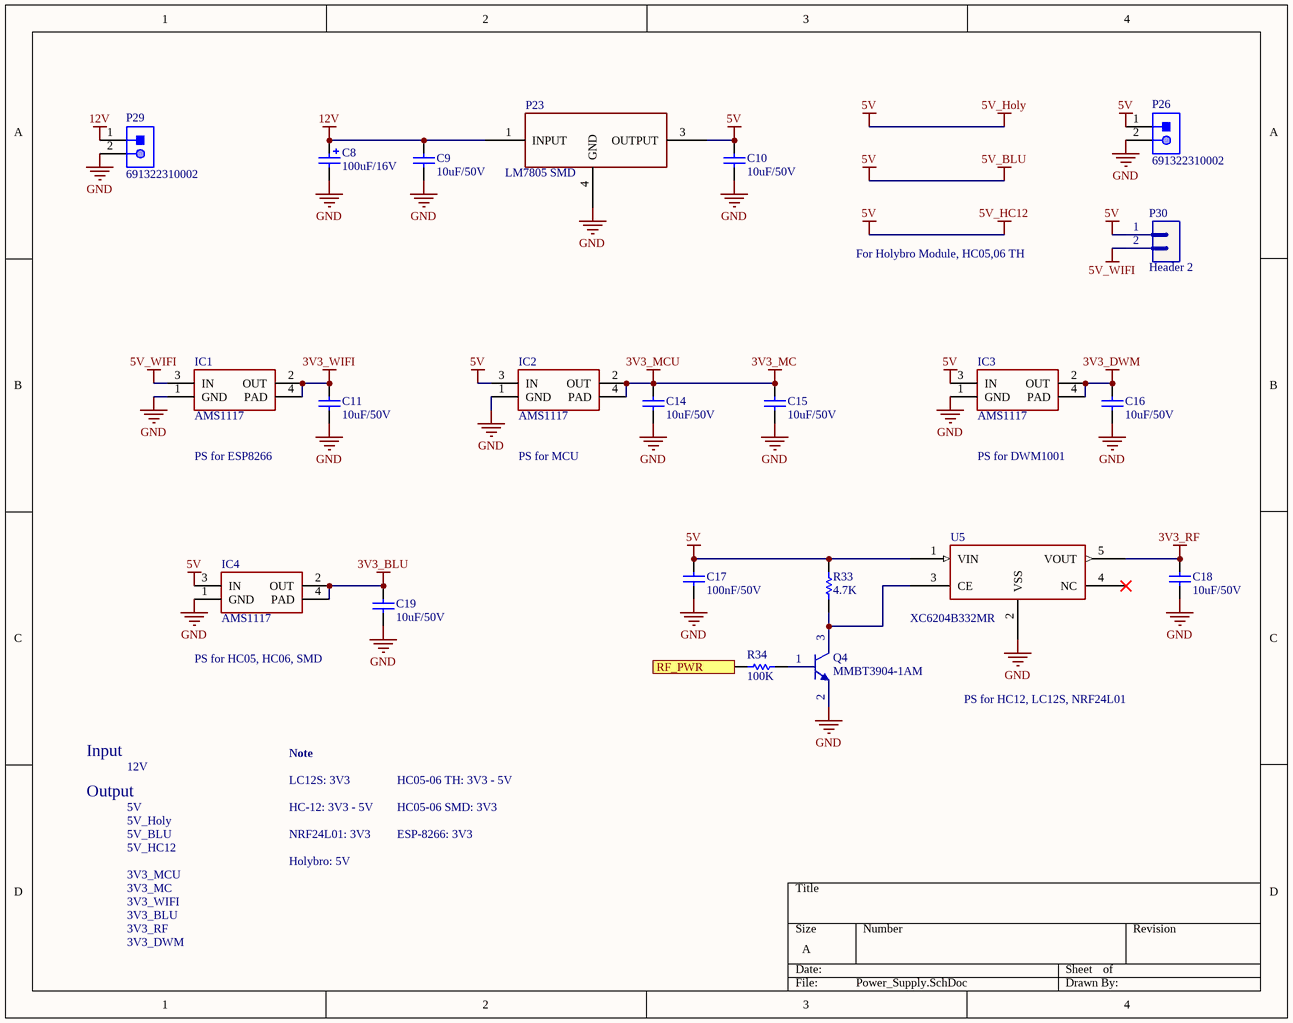
[diagram p5: Power_Supply.SchDoc]

### Parts
C8  value 100uF/16V  [CAP-SM-AL-SIZE-D-D6L6]  (hidden comment: Cap-Al-100uF-16V-D6L5)
C9  value 10uF/50V  [CAP-SM-0805]  (hidden comment: Cap-10uF-50V-0805)
C10  value 10uF/50V  [CAP-SM-0805]  (hidden comment: Cap-10uF-50V-0805)
C11  value 10uF/50V  [CAP-SM-0805]  (hidden comment: Cap-10uF-50V-0805)
C14  value 10uF/50V  [CAP-SM-0805]  (hidden comment: Cap-10uF-50V-0805)
C15  value 10uF/50V  [CAP-SM-0805]  (hidden comment: Cap-10uF-50V-0805)
C16  value 10uF/50V  [CAP-SM-0805]  (hidden comment: Cap-10uF-50V-0805)
C17  value 100nF/50V  [CAP-SM-0805]  (hidden comment: Cap-100nF-50V-0805)
C18  value 10uF/50V  [CAP-SM-0805]  (hidden comment: Cap-10uF-50V-0805)
C19  value 10uF/50V  [CAP-SM-0805]  (hidden comment: Cap-10uF-50V-0805)
IC1  AMS1117  [SOT223]
IC2  AMS1117  [SOT223]
IC3  AMS1117  [SOT223]
IC4  AMS1117  [SOT223]
P23  LM7805 SMD  [D2PAK_STM]
P26  691322310002  [691322310002]
P29  691322310002  [691322310002]
P30  Header 2  [JP2]
Q4  MMBT3904-1AM  [SOT23_NEX]
R33  value 4.7K  [RES-SM-0805]  (hidden comment: Res-4.7K-0805)
R34  value 100K  [RES-SM-0805]  (hidden comment: Res-100K-0805)
U5  XC6204B332MR  [XC6204/05_SOT-00]

### Ports
RF_PWR (in)

### Nets
3V3_BLU: C19.2 IC4.2(OUT) IC4.4(PAD)
3V3_DWM: C16.2 IC3.2(OUT) IC3.4(PAD)
3V3_MC: C14.2 C15.2 IC2.2(OUT) IC2.4(PAD)  [also labelled 3V3_MCU]
3V3_RF: C18.2 U5.5(VOUT)
3V3_WIFI: C11.2 IC1.2(OUT) IC1.4(PAD)
5V: C10.2 C17.2 IC2.3(IN) IC3.3(IN) IC4.3(IN) P23.3(OUTPUT) P26.1 P30.1 R33.2 U5.1(VIN)  [also labelled 5V_BLU, 5V_HC12, 5V_Holy]
5V_WIFI: IC1.3(IN) P30.2
12V: C8.1 C9.1 P23.1(INPUT) P29.1
GND: C8.2 C9.2 C10.1 C11.1 C14.1 C15.1 C16.1 C17.1 C18.1 C19.1 IC1.1(GND) IC2.1(GND) IC3.1(GND) IC4.1(GND) P23.4(GND) P26.2 P29.2 Q4.2(E) U5.2(VSS)
NetQ4_1: Q4.1(B) R34.2
NetQ4_3: Q4.3(C) R33.1 U5.3(CE)
NetR34_1: R34.1 ; port RF_PWR

Not connected (* = marked no-connect by the designer): U5 4(NC)*

### Notes on the sheet
- For Holybro Module, HC05,06 TH
- PS for ESP8266
- PS for MCU
- PS for DWM1001
- PS for HC05, HC06, SMD
- PS for HC12, LC12S, NRF24L01
- Input
- 12V
- Note
- Output
- 5V_Holy
- 5V_BLU
- 5V
- LC12S: 3V3
- HC-12: 3V3 - 5V
- NRF24L01: 3V3
- HC05-06 TH: 3V3 - 5V
- HC05-06 SMD: 3V3
- ESP-8266: 3V3
- 5V_HC12
- 3V3_MC
- 3V3_MCU
- 3V3_WIFI
- Holybro: 5V
- 3V3_BLU
- 3V3_RF
- 3V3_DWM

### Library data of the parts
C8 = Cap-Al-100uF-16V-D6L5: as C6 on sheet Motor Control; Local Supplier: thegioiic; Local Supplier Link: https://thegioiic.com/products/tu-nhom-smd-100uf-16v-d6-3l5-4; Supplier 1: Digikey; Supplier 1 Part Number: 493-2105-1-ND; Supplier 1 Link: https://www.digikey.com/product-detail/en/nichicon/UWX1C101MCL1GB/493-2105-1-ND/590080
C9-C11 C14-C16 C18 C19 = Cap-10uF-50V-0805: as C27 on sheet wifi; Local Supplier: thegioiic; Local Supplier Link: https://thegioiic.com/products/tu-10uf-50v-0805; Supplier 1: Digikey; Supplier 1 Link: https://www.digikey.com/product-detail/en/yageo/CC0805KKX5R9BB106/311-3499-2-ND/7164383; Supplier 1 Part Number: 311-3499-2-ND
C17 = Cap-100nF-50V-0805: as C26 on sheet wifi; Local Supplier: thegioiic; Local Supplier Link: https://thegioiic.com/products/tu-100nf-0-1uf-50v-0805; Supplier 1: Digikey; Supplier 1 Part Number: 1276-1007-1-ND; Supplier 1 Link: https://www.digikey.com/product-detail/en/samsung-electro-mechanics/CL21F104ZBCNNNC/1276-1007-1-ND/3889093
IC1-IC4 = AMS1117: Available in 1.8V, 2.5V, 2.85V, 3.3V, 5V, and  Adjustable Versions; Value: LM317
P26 P29 = 691322310002: WR-TBL Serie 322 Horizontal PCB Header, Pluggable, pitch 3.81mm, 2p; Compliance: RoHS; Modularity: No; Pin Number: 2; Rated Current [UL]: 10A; Working Voltage [UL]: 300VAC; ComponentLink1Description: Manufacturer; ComponentLink1URL: http://www.we-online.de; ComponentLink2URL: https://katalog.we-online.de/em/datasheet/691322310002.pdf; ComponentLink2Description: Datasheet; Mounting Technology: THT; Part Number: 691322310002; Packaging: Box; Operating Temperature: -40 to +105degC; PCB/Cable/Panel: PCB; Pitch: 3.81mm; Published Date: October 2019; Type: Horizontal; Publisher: Wurth Elektronik; Application: Pluggable
P30 = Header 2: Header, 2-Pin; LatestRevisionDate: 17-Jul-2002; LatestRevisionNote: Re-released for DXP Platform.; Publisher: Altium Limited
R33 = Res-4.7K-0805: RES SMD 4.7K OHM 5% 1/8W 0805; Manufacturer: Yageo; Manufacturer Part Number: RC0805JR-074K7L; Local Supplier: thegioiic; Local Supplier Link: https://thegioiic.com/products/dien-tro-4-7k-ohm-0805-5; Supplier 1: Digikey; Supplier 1 Link: https://www.digikey.com/product-detail/en/yageo/RC0805JR-074K7L/311-4.7KARCT-ND/731274; Supplier 1 Part Number: 311-4.7KARCT-ND
R34 = Res-100K-0805: RES 0 OHM JUMPER 0805; Manufacturer: Vishay Dale; Manufacturer Part Number: WSL080500000ZEA9; Local Supplier: thegioiic; Local Supplier Link: https://thegioiic.com/products/dien-tro-0-ohm-0805-5; Supplier 1: Digikey; Supplier 1 Link: https://www.digikey.com/product-detail/en/vishay-dale/WSL080500000ZEA9/541-3928-1-ND/7423223; Supplier 1 Part Number: 541-3928-1-ND
U5 = XC6204B332MR: Vendor: Torex Semiconductor; Built_By: EMA_UL_Team; SourceLibrary: Torex_2016-07-05_1; Manufacturer_Part_Number: XC6204B332MR; Copyright: Copyright (C) 2018 Accelerated Designs. All rights reserved; RefDes: RefDes; Type: DEV
P23 = LM7805 SMD: Local Supplier: *; Local Supplier Link: *; Local Supplier Part Number: *; Mannufacture: *; Mannufacture Part Number: *

## Sheet Bluetooth.SchDoc
size A
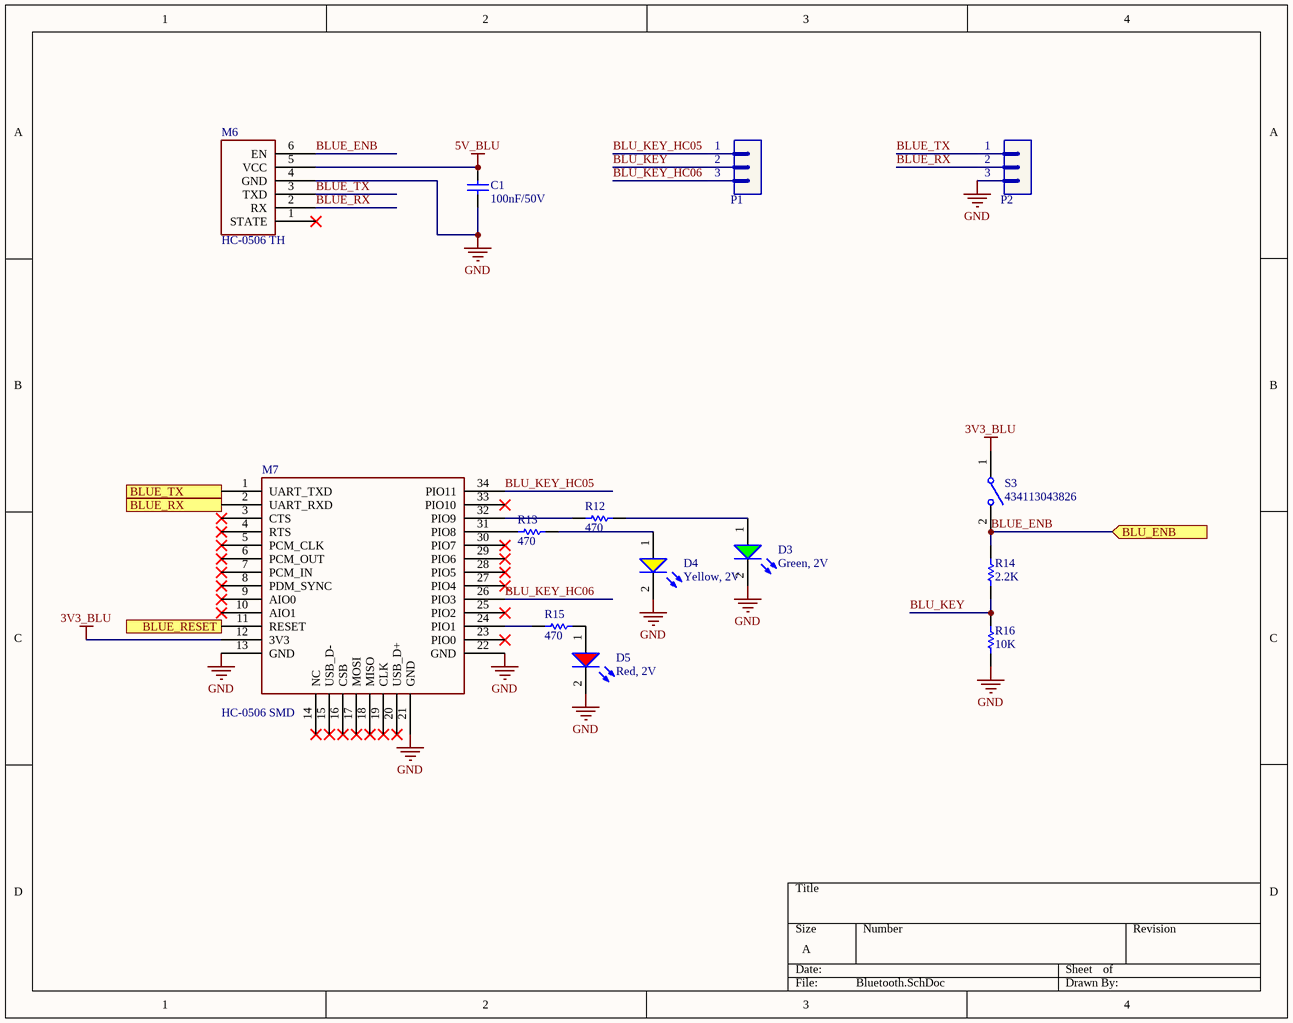
[diagram p6: Bluetooth.SchDoc]

### Parts
C1  value 100nF/50V  [CAP-SM-0805]  (hidden comment: Cap-100nF-50V-0805)
D3  value Green, 2V  [LED_0805_Blue]  (hidden comment: LED-GREEN-TH-3mm)
D4  value Yellow, 2V  [LED_0805_Blue]  (hidden comment: LED-YELLOW-TH-3mm)
D5  value Red, 2V  [LED_0805_Blue]  (hidden comment: LED-RED-TH-3mm)
M6  HC-0506 TH  [HC-0506 TH]
M7  HC-0506 SMD  [HC-0506 SMD]
P1  Header 3  [JP3]  (value not drawn)
P2  Header 3  [JP3]  (value not drawn)
R12  value 470  [RES-SM-0805]  (hidden comment: Res-470-0805)
R13  value 470  [RES-SM-0805]  (hidden comment: Res-470-0805)
R14  value 2.2K  [RES-SM-0805]  (hidden comment: Res-2.2K-0805)
R15  value 470  [RES-SM-0805]  (hidden comment: Res-470-0805)
R16  value 10K  [RES-SM-0805]  (hidden comment: Res-10k-0805)
S3  434113043826  [434113043826]

### Ports
BLU_ENB (in), BLUE_RESET (in), BLUE_RX (in), BLUE_TX (out)

### Nets
3V3_BLU: M7.12(3V3) S3.1
5V_BLU: C1.2 M6.5(VCC)  [project net 5V]
GND: C1.1 D3.2(K) D4.2(K) D5.2(K) M6.4(GND) M7.13(GND) M7.21(GND) M7.22(GND) P2.3 R16.1
BLU_KEY: P1.2 R14.1 R16.2
BLU_KEY_HC05: M7.34(PIO11) P1.1
BLU_KEY_HC06: M7.26(PIO3) P1.3
BLUE_ENB: M6.6(EN) R14.2 S3.2 ; port BLU_ENB
BLUE_RX: M6.2(RX) P2.2
BLUE_TX: M6.3(TXD) P2.1
NetD3_1: D3.1(A) R12.2
NetD4_1: D4.1(A) R13.2
NetD5_1: D5.1(A) R15.2
NetM7_1: M7.1(UART_TXD) ; port BLUE_TX
NetM7_2: M7.2(UART_RXD) ; port BLUE_RX
NetM7_11: M7.11(RESET) ; port BLUE_RESET
NetM7_24: M7.24(PIO1) R15.1
NetM7_31: M7.31(PIO8) R13.1
NetM7_32: M7.32(PIO9) R12.1

Not connected (* = marked no-connect by the designer): M6 1(STATE)*; M7 3(CTS)* 4(RTS)* 5(PCM_CLK)* 6(PCM_OUT)* 7(PCM_IN)* 8(PDM_SYNC)* 9(AIO0)* 10(AIO1)* 14(NC)* 15(USB_D-)* 16(CSB)* 17(MOSI)* 18(MISO)* 19(CLK)* 20(USB_D+)* 23(PIO0)* 25(PIO2)* 27(PIO4)* 28(PIO5)* 29(PIO6)* 30(PIO7)* 33(PIO10)*

### Library data of the parts
C1 = Cap-100nF-50V-0805: as C26 on sheet wifi; Local Supplier: thegioiic; Local Supplier Link: https://thegioiic.com/products/tu-100nf-0-1uf-50v-0805; Supplier 1: Digikey; Supplier 1 Part Number: 1276-1007-1-ND; Supplier 1 Link: https://www.digikey.com/product-detail/en/samsung-electro-mechanics/CL21F104ZBCNNNC/1276-1007-1-ND/3889093
D3 = LED-GREEN-TH-3mm: as D9 on sheet Decawave; Local Supplier: thegioiic; Local Supplier Link: https://thegioiic.com/products/led-xanh-la-3mm-chan-dai; Supplier 1: Digikey; Supplier 1 Link: https://www.digikey.com/product-detail/en/kingbright/WP710A10ZGC-G/754-1612-ND/2769684; Supplier 1 Part Number: 754-1612-ND
D5 = LED-RED-TH-3mm: as D2 on sheet wifi; Local Supplier: thegioiic; Local Supplier Link: https://thegioiic.com/products/led-do-3mm-chan-dai; Supplier 1: Digikey; Supplier 1 Link: https://www.digikey.com/product-detail/en/kingbright/WP710A10SEC-J3/754-1589-ND/2769815; Supplier 1 Part Number: 754-1589-ND
P1 P2 = Header 3: Header, 3-Pin; LatestRevisionDate: 17-Jul-2002; LatestRevisionNote: Re-released for DXP Platform.; Publisher: Altium Limited
R12 R13 R15 = Res-470-0805: RES 470 OHM JUMPER 0805; Manufacturer: YAG6006CT-ND; Manufacturer Part Number: PE0805FRF7W0R047L; Local Supplier: thegioiic; Local Supplier Link: https://www.thegioiic.com/products/dien-tro-470-kohm-0805-5; Supplier 1: Digikey; Supplier 1 Link: https://www.digikey.com/product-detail/en/yageo/PE0805FRF7W0R047L/YAG6006CT-ND/9696460; Supplier 1 Part Number: YAG6006CT-ND
R14 = Res-2.2K-0805: RES SMD 2.2K OHM 1% 1/8W 0805; Manufacturer: TE Connectivity Passive Product; Manufacturer Part Number: CRG0805F2K2; Local Supplier: thegioiic; Local Supplier Link: https://thegioiic.com/products/dien-tro-2-2k-ohm-0805-5; Supplier 1: Digikey; Supplier 1 Link: https://www.digikey.com/product-detail/en/te-connectivity-passive-product/CRG0805F2K2/A106060CT-ND/3477706; Supplier 1 Part Number: A106060CT-ND
R16 = Res-10k-0805: as R37 on sheet Decawave; Local Supplier: thegioiic; Local Supplier Link: https://thegioiic.com/products/dien-tro-10k-ohm-0805-5; Supplier 1: Digikey; Supplier 1 Link: https://www.digikey.com/product-detail/en/stackpole-electronics-inc/RNCP0805FTD10K0/RNCP0805FTD10K0CT-ND/2240601; Supplier 1 Part Number: RNCP0805FTD10K0CT-ND
S3 = 434113043826: as S6 on sheet Decawave; ComponentLink1Description: Manufacturer; ComponentLink1URL: http://www.we-online.de; ComponentLink2Description: Datasheet; ComponentLink2URL: https://katalog.we-online.com/em/datasheet/434113043826.pdf; Operating Temperature: -40 to +85degC; Part Number: 434113043826; Published Date: September 2019; Contact Material: Stainless Steel; Height: 4.3mm; Mounting Technology: SMT; Contact Plating: Silver; Operation Force: 260gf; Packaging: Tape and Reel; Terminal Material: Copper Alloy; Publisher: Wurth Elektronik; Terminal Plating: Silver
M6 = HC-0506 TH: Manufacturer Part Number: *; Manufacturer: *; Local Supplier Part Number: HS000882; Local Supplier Link: https://hshop.vn/products/mach-thu-phat-bluetooth-hc-05-do-ra-chon-master; Local Supplier: HShop
M7 = HC-0506 SMD: Local Supplier: HShop; Local Supplier Link: https://hshop.vn/products/mach-thu-phat-bluetooth-hc-05-chua-ra-chon-master; Local Supplier Part Number: HS000881; Manufacturer: *; Manufacturer Part Number: *

## Sheet MCU.schdoc
size A4
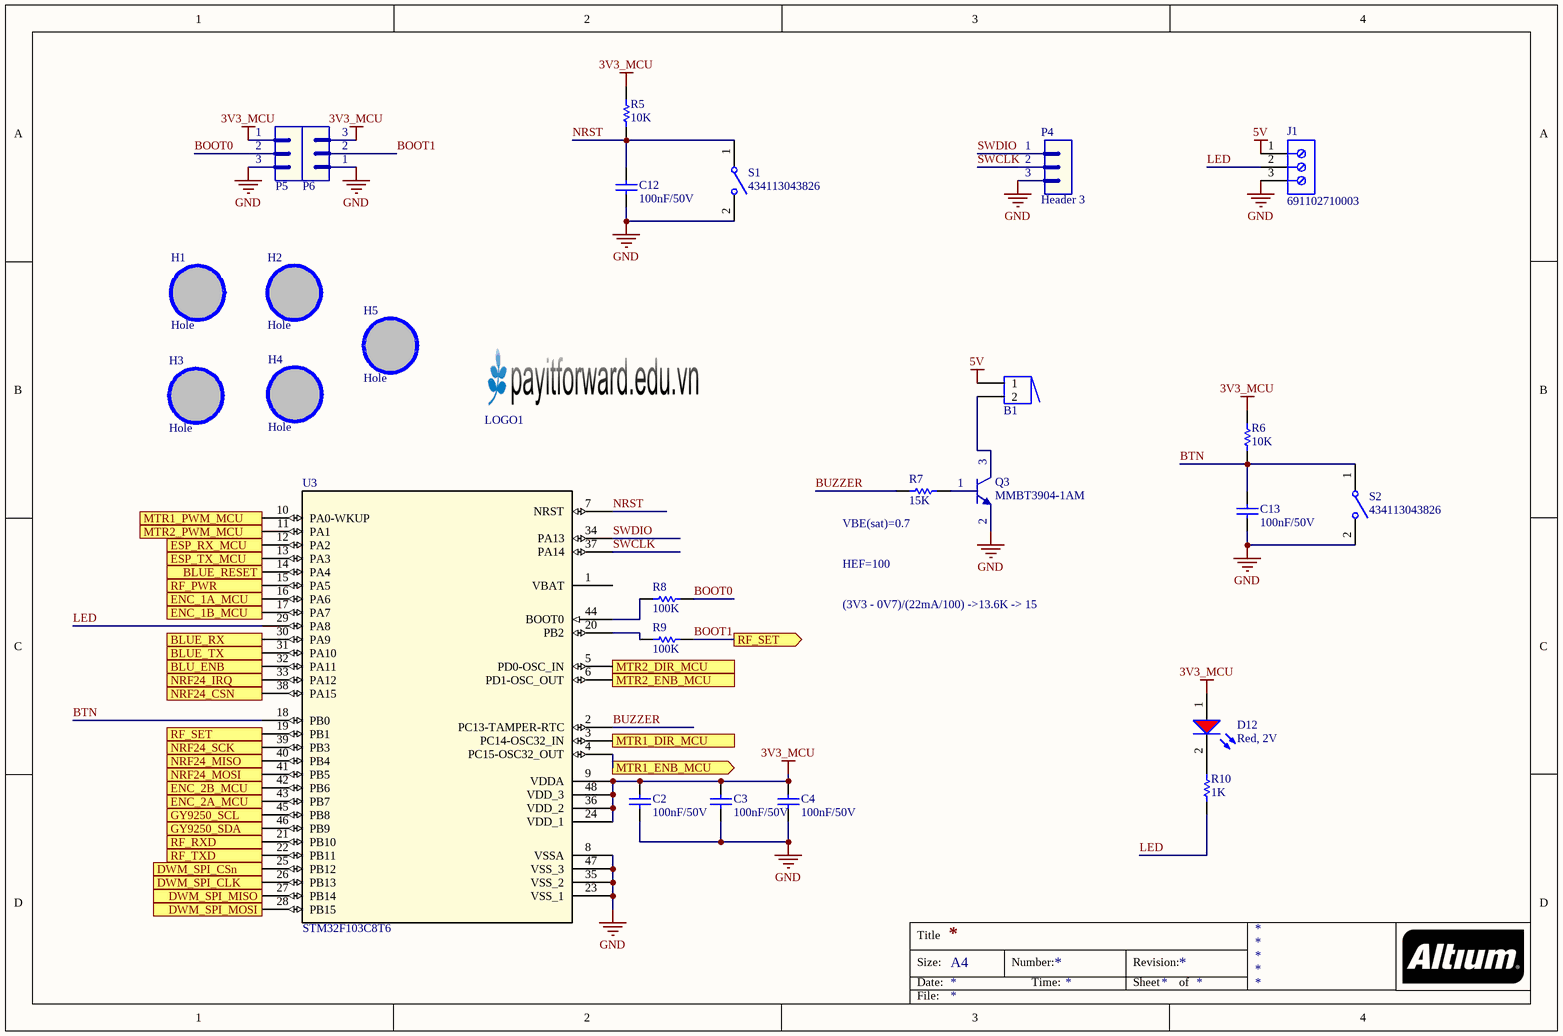
[diagram p7: MCU.schdoc]

### Parts
B1  Buzzer  [BUZZER]  (value not drawn)
C2  value 100nF/50V  [CAP-SM-0805]  (hidden comment: Cap-100nF-50V-0805)
C3  value 100nF/50V  [CAP-SM-0805]  (hidden comment: Cap-100nF-50V-0805)
C4  value 100nF/50V  [CAP-SM-0805]  (hidden comment: Cap-100nF-50V-0805)
C12  value 100nF/50V  [CAP-SM-0805]  (hidden comment: Cap-100nF-50V-0805)
C13  value 100nF/50V  [CAP-SM-0805]  (hidden comment: Cap-100nF-50V-0805)
D12  value Red, 2V  [LED-3mm]  (hidden comment: LED-RED-TH-3mm)
H1  Hole  [LO KHOAN 3MM]
H2  Hole  [LO KHOAN 3MM]
H3  Hole  [LO KHOAN 3MM]
H4  Hole  [LO KHOAN 3MM]
H5  Hole  [LO KHOAN 3MM]
J1  691102710003  [691102710003]
LOGO1  LOGO PIF  [PIF LOGO BIG SSTOP]  (value not drawn)
P4  Header 3  [JP3]
P5  Header 3  [JP3]  (value not drawn)
P6  Header 3  [JP3]  (value not drawn)
Q3  MMBT3904-1AM  [SOT23_NEX]
R5  value 10K  [RES-SM-0805]  (hidden comment: Res-10k-0805)
R6  value 10K  [RES-SM-0805]  (hidden comment: Res-10k-0805)
R7  value 15K  [RES-SM-0805]  (hidden comment: Res-15K-0805)
R8  value 100K  [RES-SM-0805]  (hidden comment: Res-100K-0805)
R9  value 100K  [RES-SM-0805]  (hidden comment: Res-100K-0805)
R10  value 1K  [RES-SM-0805]  (hidden comment: Res-1K-0805)
S1  434113043826  [434113043826]
S2  434113043826  [434113043826]
U3  STM32F103C8T6  [LQFP-48]

### Ports
BLU_ENB (out), BLUE_RESET (out), BLUE_RX (out), BLUE_TX (in), DWM_SPI_CLK (out), DWM_SPI_CSn (out), DWM_SPI_MISO (in), DWM_SPI_MOSI (out), ENC_1A_MCU (in), ENC_1B_MCU (in), ENC_2A_MCU (in), ENC_2B_MCU (in), ESP_RX_MCU (out), ESP_TX_MCU (in), GY9250_SCL (out), GY9250_SDA (out), MTR1_DIR_MCU (out), MTR1_ENB_MCU (out), MTR1_PWM_MCU (out), MTR2_DIR_MCU (out), MTR2_ENB_MCU (out), MTR2_PWM_MCU (out), NRF24_CSN (out), NRF24_IRQ (in), NRF24_MISO (in), NRF24_MOSI (out), NRF24_SCK (out), RF_PWR (out), RF_RXD (out), RF_SET (out), RF_TXD (in)

### Nets
3V3_MCU: C2.2 C3.2 C4.2 D12.1(A) P5.1 P6.3 R5.2 R6.2 U3.9(VDDA) U3.24(VDD_1) U3.36(VDD_2) U3.48(VDD_3)  [project net 3V3_MC]
5V: B1.1 J1.1
GND: C2.1 C3.1 C4.1 C12.1 C13.1 J1.3 P4.3 P5.3 P6.1 Q3.2(E) S1.2 S2.2 U3.8(VSSA) U3.23(VSS_1) U3.35(VSS_2) U3.47(VSS_3)
BLUE_ENB: U3.32(PA11) ; port BLU_ENB
BOOT0: P5.2 R8.2
BOOT1: P6.2 R9.2 U3.19(PB1) ; port RF_SET
BTN: C13.2 R6.1 S2.1 U3.18(PB0)
BUZZER: R7.1 U3.2(PC13-TAMPER-RTC)
DWM_SPI_CLK: U3.26(PB13) ; port DWM_SPI_CLK
DWM_SPI_CSn: U3.25(PB12) ; port DWM_SPI_CSn
DWM_SPI_MISO: U3.27(PB14) ; port DWM_SPI_MISO
DWM_SPI_MOSI: U3.28(PB15) ; port DWM_SPI_MOSI
ESP_TX: U3.13(PA3) ; port ESP_TX_MCU
LED: J1.2 R10.1 U3.29(PA8)
NRST: C12.2 R5.1 S1.1 U3.7(NRST)
RF_RXD: U3.21(PB10) ; port RF_RXD
RF_TXD: U3.22(PB11) ; port RF_TXD
SWCLK: P4.2 U3.37(PA14)
SWDIO: P4.1 U3.34(PA13)
NetB1_2: B1.2 Q3.3(C)
NetD12_2: D12.2(K) R10.2
NetM1_4: U3.38(PA15) ; port NRF24_CSN
NetM1_5: U3.39(PB3) ; port NRF24_SCK
NetM1_6: U3.41(PB5) ; port NRF24_MOSI
NetM1_7: U3.40(PB4) ; port NRF24_MISO
NetM1_8: U3.33(PA12) ; port NRF24_IRQ
NetM7_1: U3.31(PA10) ; port BLUE_TX
NetM7_2: U3.30(PA9) ; port BLUE_RX
NetM7_11: U3.14(PA4) ; port BLUE_RESET
NetM10_3: U3.45(PB8) ; port GY9250_SCL
NetM10_4: U3.46(PB9) ; port GY9250_SDA
NetQ3_1: Q3.1(B) R7.2
NetR8_1: R8.1 U3.44(BOOT0)
NetR9_1: R9.1 U3.20(PB2)
NetR11_2: U3.12(PA2) ; port ESP_RX_MCU
NetR34_1: U3.15(PA5) ; port RF_PWR
NetU3_3: U3.3(PC14-OSC32_IN) ; port MTR1_DIR_MCU
NetU3_4: U3.4(PC15-OSC32_OUT) ; port MTR1_ENB_MCU
NetU3_5: U3.5(PD0-OSC_IN) ; port MTR2_DIR_MCU
NetU3_6: U3.6(PD1-OSC_OUT) ; port MTR2_ENB_MCU
NetU3_10: U3.10(PA0-WKUP) ; port MTR1_PWM_MCU
NetU3_11: U3.11(PA1) ; port MTR2_PWM_MCU
NetU3_16: U3.16(PA6) ; port ENC_1A_MCU
NetU3_17: U3.17(PA7) ; port ENC_1B_MCU
NetU3_42: U3.42(PB6) ; port ENC_2B_MCU
NetU3_43: U3.43(PB7) ; port ENC_2A_MCU

Not connected (* = marked no-connect by the designer): H1 1; H2 1; H3 1; H4 1; H5 1; U3 1(VBAT)

### Notes on the sheet
- (near R7) VBE(sat)=0.7
- HEF=100
- (3V3 - 0V7)/(22mA/100) ->13.6K -> 15
- Title
- Size:
- Date:
- A4
- Number:
- Time:
- Revision:
- Sheet
- of
- File:

### Library data of the parts
C2-C4 C12 C13 = Cap-100nF-50V-0805: as C26 on sheet wifi; Local Supplier: thegioiic; Local Supplier Link: https://thegioiic.com/products/tu-100nf-0-1uf-50v-0805; Supplier 1: Digikey; Supplier 1 Part Number: 1276-1007-1-ND; Supplier 1 Link: https://www.digikey.com/product-detail/en/samsung-electro-mechanics/CL21F104ZBCNNNC/1276-1007-1-ND/3889093
D12 = LED-RED-TH-3mm: as D2 on sheet wifi; Local Supplier: thegioiic; Local Supplier Link: https://thegioiic.com/products/led-do-3mm-chan-dai; Supplier 1: Digikey; Supplier 1 Link: https://www.digikey.com/product-detail/en/kingbright/WP710A10SEC-J3/754-1589-ND/2769815; Supplier 1 Part Number: 754-1589-ND
H1-H5 = Hole: Hole 3mm
J1 = 691102710003: WR-TBL Serie 102 Horizontal Entry Modular, Pressure Clamp, pitch 5mm, 3p; Compliance: Lead free / RoHS; Modularity: Yes; PCB/Cable/Panel: PCB; Pin Number: 3; Rated Current [UL]: 15A; Working Voltage [UL]: 250VAC; ComponentLink1Description: Manufacturer; ComponentLink1URL: http://www.we-online.de; ComponentLink2URL: https://katalog.we-online.de/em/datasheet/691102710003.pdf; ComponentLink2Description: Datasheet; Mounting Technology: THT; Part Number: 691102710003; Packaging: Box; Operating Temperature: -40 to +105degC; Pitch: 5mm; Published Date: October 2019; Type: Horizontal; Publisher: Wurth Elektronik; Application: Pressure Clamp
P4-P6 = Header 3: Header, 3-Pin; LatestRevisionDate: 17-Jul-2002; LatestRevisionNote: Re-released for DXP Platform.; Publisher: Altium Limited
R5 R6 = Res-10k-0805: as R37 on sheet Decawave; Local Supplier: thegioiic; Local Supplier Link: https://thegioiic.com/products/dien-tro-10k-ohm-0805-5; Supplier 1: Digikey; Supplier 1 Link: https://www.digikey.com/product-detail/en/stackpole-electronics-inc/RNCP0805FTD10K0/RNCP0805FTD10K0CT-ND/2240601; Supplier 1 Part Number: RNCP0805FTD10K0CT-ND
R7 = Res-15K-0805: RES 15K OHM 1% 1/4W 0805; Manufacturer: TE Connectivity Passive Product; Manufacturer Part Number: CRGCQ0805F15K; Local Supplier: thegioiic; Local Supplier Link: https://thegioiic.com/products/dien-tro-15k-ohm-0805-1; Supplier 1: Digikey; Supplier 1 Part Number: A129763CT-ND; Supplier 1 Link: https://www.digikey.com/product-detail/en/te-connectivity-passive-product/CRGCQ0805F15K/A129763CT-ND/8577595
R8 R9 = Res-100K-0805: as R34 on sheet Power_Supply; Local Supplier: thegioiic; Local Supplier Link: https://thegioiic.com/products/dien-tro-0-ohm-0805-5; Supplier 1: Digikey; Supplier 1 Link: https://www.digikey.com/product-detail/en/vishay-dale/WSL080500000ZEA9/541-3928-1-ND/7423223; Supplier 1 Part Number: 541-3928-1-ND
R10 = Res-1K-0805: as R11 on sheet wifi; Local Supplier: thegioiic; Local Supplier Link: https://thegioiic.com/products/dien-tro-1k-ohm-0805-5; Supplier 1: Digikey; Supplier 1 Link: https://www.digikey.com/product-detail/en/stackpole-electronics-inc/RNCP0805FTD1K00/RNCP0805FTD1K00CT-ND/2240568; Supplier 1 Part Number: RNCP0805FTD1K00CT-ND
S1 S2 = 434113043826: as S6 on sheet Decawave; ComponentLink1Description: Manufacturer; ComponentLink1URL: http://www.we-online.de; ComponentLink2Description: Datasheet; ComponentLink2URL: https://katalog.we-online.com/em/datasheet/434113043826.pdf; Operating Temperature: -40 to +85degC; Part Number: 434113043826; Published Date: September 2019; Contact Material: Stainless Steel; Height: 4.3mm; Mounting Technology: SMT; Contact Plating: Silver; Operation Force: 260gf; Packaging: Tape and Reel; Terminal Material: Copper Alloy; Publisher: Wurth Elektronik; Terminal Plating: Silver
U3 = STM32F103C8T6: No Description Available; SourceLibrary: StMicro_2011-06-07; Built_By: EMA_UL_Team; Vendor: STMicroelectronics; Manufacturer_Part_Number: STM32F103C8T6; Copyright: Copyright (C) 2018 Accelerated Designs. All rights reserved; RefDes: RefDes; Type: DEV

## Nets that join several sheets
3V3_BLU: Power_Supply (C19.2 IC4.2 IC4.4), Bluetooth (M7.12 S3.1)
3V3_DWM: Decawave (P3.2), Power_Supply (C16.2 IC3.2 IC3.4)
3V3_MC: Sensor (C24.2 C34.2 M10.1 U6.14), Motor Control (11 pins), Power_Supply (C14.2 C15.2 IC2.2 IC2.4), MCU (12 pins)
3V3_RF: RF (C20.2 M1.2 P28.2 P31.2), Power_Supply (C18.2 U5.5)
3V3_WIFI: wifi (11 pins), Power_Supply (C11.2 IC1.2 IC1.4)
5V: RF (C22.2 M4.1), Motor Control (P9.3), Power_Supply (10 pins), Bluetooth (C1.2 M6.5), MCU (B1.1 J1.1)
5V_WIFI: wifi (C29.2 C30.2 D1.1 U1.8), Power_Supply (IC1.3 P30.2)
12V: Motor Control (P7.1 P8.1), Power_Supply (C8.1 C9.1 P23.1 P29.1)
GND: wifi (14 pins), Sensor (6 pins), RF (9 pins), Motor Control (19 pins), Decawave (16 pins), Power_Supply (19 pins), Bluetooth (10 pins), MCU (16 pins)
BLUE_ENB: Bluetooth (M6.6 R14.2 S3.2), MCU (U3.32)
BOOT1: RF (M2.4 P27.3), MCU (P6.2 R9.2 U3.19)
DWM_SPI_CLK: Decawave (P22.3 U2.28), MCU (U3.26)
DWM_SPI_CSn: Decawave (P22.2 U2.29), MCU (U3.25)
DWM_SPI_MISO: Decawave (P22.5 U2.26), MCU (U3.27)
DWM_SPI_MOSI: Decawave (P22.4 U2.27), MCU (U3.28)
ESP_TX: wifi (M5.22 U1.25), MCU (U3.13)
NetM1_4: RF (M1.4), MCU (U3.38)
NetM1_5: RF (M1.5), MCU (U3.39)
NetM1_6: RF (M1.6), MCU (U3.41)
NetM1_7: RF (M1.7), MCU (U3.40)
NetM1_8: RF (M1.8), MCU (U3.33)
NetM7_1: Bluetooth (M7.1), MCU (U3.31)
NetM7_2: Bluetooth (M7.2), MCU (U3.30)
NetM7_11: Bluetooth (M7.11), MCU (U3.14)
NetM10_3: Sensor (M10.3), MCU (U3.45)
NetM10_4: Sensor (M10.4), MCU (U3.46)
NetR11_2: wifi (R11.2), MCU (U3.12)
NetR34_1: Power_Supply (R34.1), MCU (U3.15)
NetU3_3: Motor Control (U4.3), MCU (U3.3)
NetU3_4: Motor Control (U4.6), MCU (U3.4)
NetU3_5: Motor Control (U4.5), MCU (U3.5)
NetU3_6: Motor Control (U4.7), MCU (U3.6)
NetU3_10: Motor Control (U4.2), MCU (U3.10)
NetU3_11: Motor Control (U4.4), MCU (U3.11)
NetU3_16: Sensor (U6.2), MCU (U3.16)
NetU3_17: Sensor (U6.4), MCU (U3.17)
NetU3_42: Sensor (U6.8), MCU (U3.42)
NetU3_43: Sensor (U6.6), MCU (U3.43)
RF_RXD: RF (M2.2 M3.3 M4.2 P27.5), MCU (U3.21)
RF_TXD: RF (M2.3 M3.4 M4.3 P27.4), MCU (U3.22)